# EAGLE design rpi2_test (EAGLE 7.6.0)
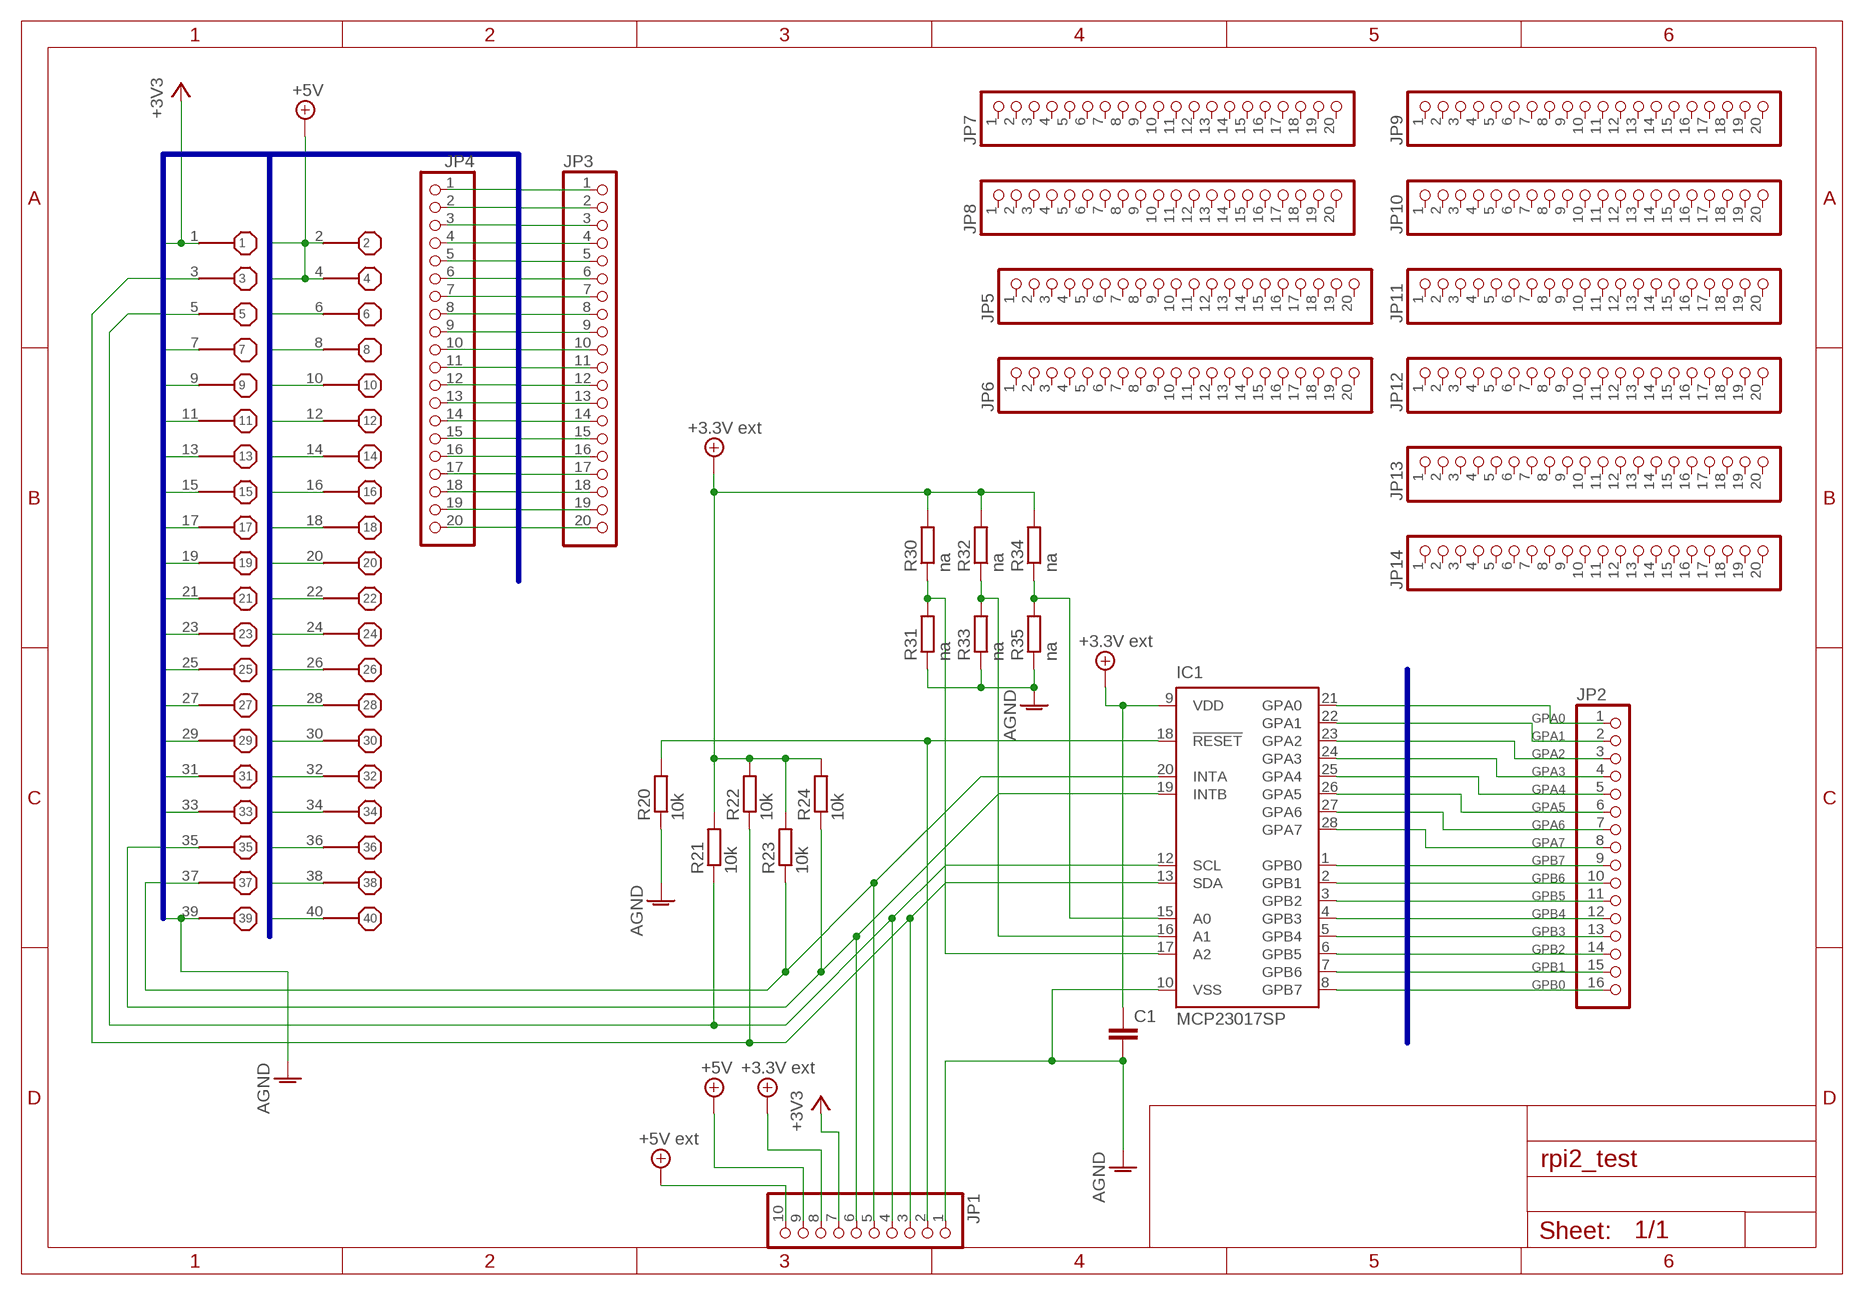
[diagram p0: schematic, sheet 1]

## Parts
C1  C-EUC1210  [C1210]
IC1  MCP23017SP  [DIL28-3]
JP1  PINHD-1X10  [1X10]
JP2  PINHD-1X16  [1X16]
JP3  PINHD-1X20  [1X20]
JP4  PINHD-1X20  [1X20]
JP5  PINHD-1X20  [1X20]
JP6  PINHD-1X20  [1X20]
JP7  PINHD-1X20  [1X20]
JP8  PINHD-1X20  [1X20]
JP9  PINHD-1X20  [1X20]
JP10  PINHD-1X20  [1X20]
JP11  PINHD-1X20  [1X20]
JP12  PINHD-1X20  [1X20]
JP13  PINHD-1X20  [1X20]
JP14  PINHD-1X20  [1X20]
R20  10k  R-EU_R0805  [R0805]
R21  10k  R-EU_R0805  [R0805]
R22  10k  R-EU_R0805  [R0805]
R23  10k  R-EU_R0805  [R0805]
R24  10k  R-EU_R0805  [R0805]
R30  na  R-EU_R0805  [R0805]
R31  na  R-EU_R0805  [R0805]
R32  na  R-EU_R0805  [R0805]
R33  na  R-EU_R0805  [R0805]
R34  na  R-EU_R0805  [R0805]
R35  na  R-EU_R0805  [R0805]
X1  B+_GPIO  [B+_GPIO]

## Nets
3.3VEXT: C1.1 IC1.9(VDD) JP1.8 R21.2 R22.2 R23.2 R24.2 R30.2 R32.2 R34.2 ; supply symbol labelled +3.3V ext
+3V3: JP1.7 JP4.1 X1.1
+5V: JP1.9 JP3.1 JP3.2 X1.2 X1.4
+5V/1: JP1.10 ; supply symbol labelled +5V ext
AGND: C1.2 IC1.10(VSS) JP1.1 R20.1 R31.1 R33.1 R35.1 X1.39
GPA0: IC1.21(GPA0) JP2.1
GPA1: IC1.22(GPA1) JP2.2
GPA2: IC1.23(GPA2) JP2.3
GPA3: IC1.24(GPA3) JP2.4
GPA4: IC1.25(GPA4) JP2.5
GPA5: IC1.26(GPA5) JP2.6
GPA6: IC1.27(GPA6) JP2.7
GPA7: IC1.28(GPA7) JP2.8
GPB0: IC1.1(GPB0) JP2.16
GPB1: IC1.2(GPB1) JP2.15
GPB2: IC1.3(GPB2) JP2.14
GPB3: IC1.4(GPB3) JP2.13
GPB4: IC1.5(GPB4) JP2.12
GPB5: IC1.6(GPB5) JP2.11
GPB6: IC1.7(GPB6) JP2.10
GPB7: IC1.8(GPB7) JP2.9
GPIO3: IC1.13(SDA) JP1.3 JP4.2 R22.1 X1.3
GPIO5: IC1.12(SCL) JP1.4 JP4.3 R21.1 X1.5
GPIO6: JP3.3 X1.6
GPIO7: JP4.4 X1.7
GPIO8: JP3.4 X1.8
GPIO9: JP4.5 X1.9
GPIO10: JP3.5 X1.10
GPIO11: JP4.6 X1.11
GPIO12: JP3.6 X1.12
GPIO13: JP4.7 X1.13
GPIO14: JP3.7 X1.14
GPIO15: JP4.8 X1.15
GPIO16: JP3.8 X1.16
GPIO17: JP4.9 X1.17
GPIO18: JP3.9 X1.18
GPIO19: JP4.10 X1.19
GPIO20: JP3.10 X1.20
GPIO21: JP4.11 X1.21
GPIO22: JP3.11 X1.22
GPIO23: JP4.12 X1.23
GPIO24: JP3.12 X1.24
GPIO25: JP4.13 X1.25
GPIO26: JP3.13 X1.26
GPIO27: JP4.14 X1.27
GPIO28: JP3.14 X1.28
GPIO29: JP4.15 X1.29
GPIO30: JP3.15 X1.30
GPIO31: JP4.16 X1.31
GPIO32: JP3.16 X1.32
GPIO33: JP4.17 X1.33
GPIO34: JP3.17 X1.34
GPIO35: IC1.19(INTB) JP1.6 JP4.18 R24.1 X1.35
GPIO36: JP3.18 X1.36
GPIO37: IC1.20(INTA) JP1.5 JP4.19 R23.1 X1.37
GPIO38: JP3.19 X1.38
GPIO39: JP4.20
GPIO40: JP3.20 X1.40
N$1: IC1.18(!RESET) JP1.2 R20.2
N$23: IC1.17(A2) R30.1 R31.2
N$29: IC1.16(A1) R32.1 R33.2
N$30: IC1.15(A0) R34.1 R35.2
Unconnected: JP5.1 JP5.2 JP5.3 JP5.4 JP5.5 JP5.6 JP5.7 JP5.8 JP5.9 JP5.10 JP5.11 JP5.12 JP5.13 JP5.14 JP5.15 JP5.16 JP5.17 JP5.18 JP5.19 JP5.20 JP6.1 JP6.2 JP6.3 JP6.4 JP6.5 JP6.6 JP6.7 JP6.8 JP6.9 JP6.10 JP6.11 JP6.12 JP6.13 JP6.14 JP6.15 JP6.16 JP6.17 JP6.18 JP6.19 JP6.20 JP7.1 JP7.2 JP7.3 JP7.4 JP7.5 JP7.6 JP7.7 JP7.8 JP7.9 JP7.10 JP7.11 JP7.12 JP7.13 JP7.14 JP7.15 JP7.16 JP7.17 JP7.18 JP7.19 JP7.20 JP8.1 JP8.2 JP8.3 JP8.4 JP8.5 JP8.6 JP8.7 JP8.8 JP8.9 JP8.10 JP8.11 JP8.12 JP8.13 JP8.14 JP8.15 JP8.16 JP8.17 JP8.18 JP8.19 JP8.20 JP9.1 JP9.2 JP9.3 JP9.4 JP9.5 JP9.6 JP9.7 JP9.8 JP9.9 JP9.10 JP9.11 JP9.12 JP9.13 JP9.14 JP9.15 JP9.16 JP9.17 JP9.18 JP9.19 JP9.20 JP10.1 JP10.2 JP10.3 JP10.4 JP10.5 JP10.6 JP10.7 JP10.8 JP10.9 JP10.10 JP10.11 JP10.12 JP10.13 JP10.14 JP10.15 JP10.16 JP10.17 JP10.18 JP10.19 JP10.20 JP11.1 JP11.2 JP11.3 JP11.4 JP11.5 JP11.6 JP11.7 JP11.8 JP11.9 JP11.10 JP11.11 JP11.12 JP11.13 JP11.14 JP11.15 JP11.16 JP11.17 JP11.18 JP11.19 JP11.20 JP12.1 JP12.2 JP12.3 JP12.4 JP12.5 JP12.6 JP12.7 JP12.8 JP12.9 JP12.10 JP12.11 JP12.12 JP12.13 JP12.14 JP12.15 JP12.16 JP12.17 JP12.18 JP12.19 JP12.20 JP13.1 JP13.2 JP13.3 JP13.4 JP13.5 JP13.6 JP13.7 JP13.8 JP13.9 JP13.10 JP13.11 JP13.12 JP13.13 JP13.14 JP13.15 JP13.16 JP13.17 JP13.18 JP13.19 JP13.20 JP14.1 JP14.2 JP14.3 JP14.4 JP14.5 JP14.6 JP14.7 JP14.8 JP14.9 JP14.10 JP14.11 JP14.12 JP14.13 JP14.14 JP14.15 JP14.16 JP14.17 JP14.18 JP14.19 JP14.20

## Buses
GPA[0..7],GPB[0..7]
GPIO[1..40]

## Library data of the parts
C1 = rcl:C-EU: CAPACITOR, European symbol
IC1 = microchip:MCP23017: http://ww1.microchip.com/downloads/en/DeviceDoc/21952a.pdf Source: http://ww1.microchip.com/downloads/en/DeviceDoc/21952a.pdf; MF: MICROCHIP; MPN: MCP23017-E/SP; OC_FARNELL: 1332088; OC_NEWARK: 31K2959
JP1 = pinhead:PINHD-1X10: PIN HEADER
JP2 = pinhead:PINHD-1X16: PIN HEADER
JP3-JP14 = pinhead:PINHD-1X20: PIN HEADER
R20-R24 R30-R35 = rcl:R-EU_: RESISTOR, European symbol
X1 = raspberry:B+_GPIO

## Board
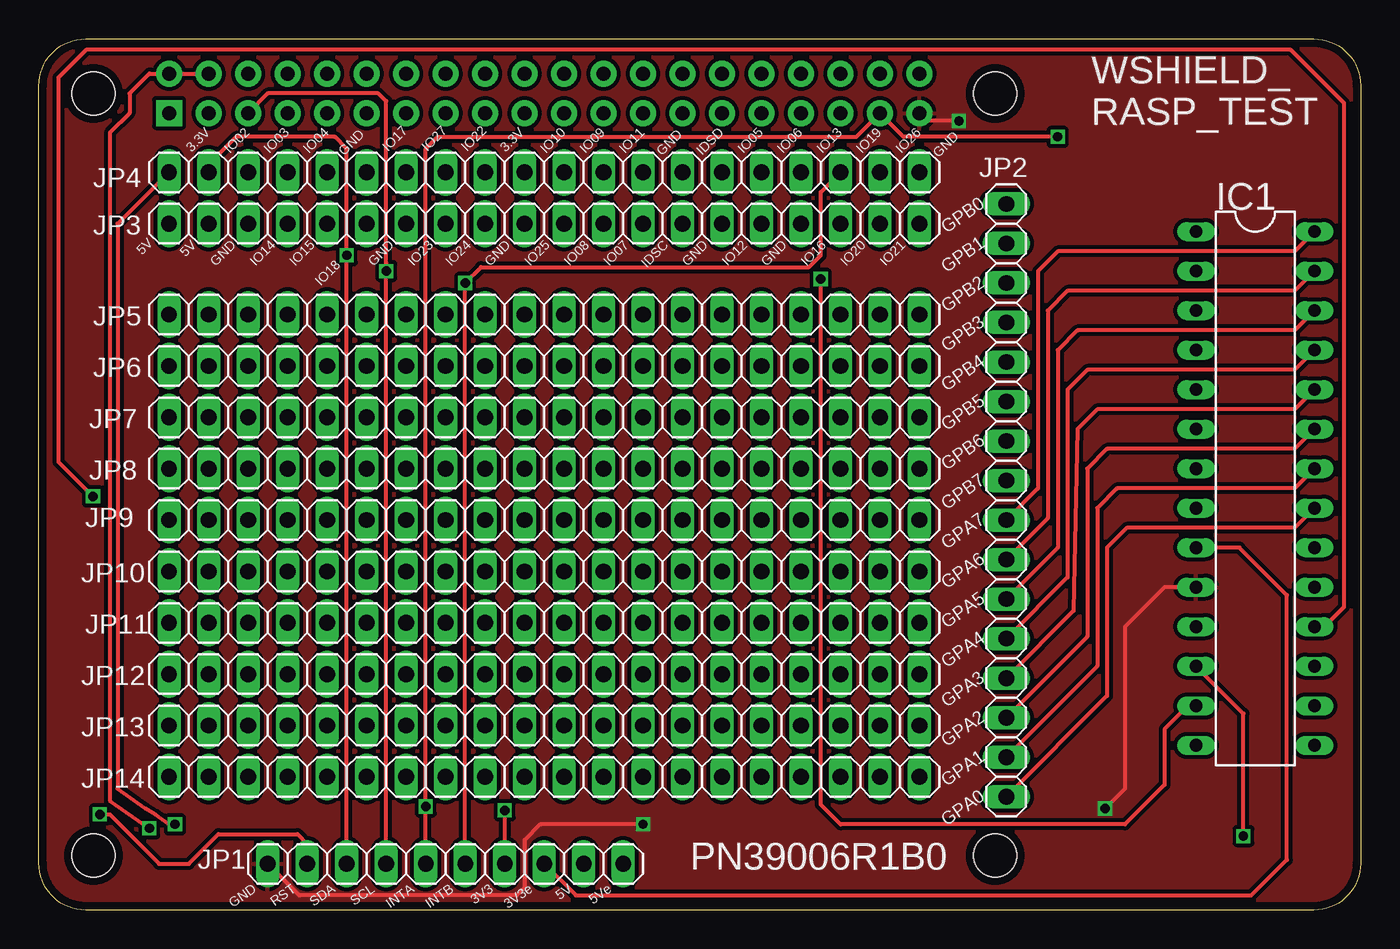
[diagram p1: board, top side]
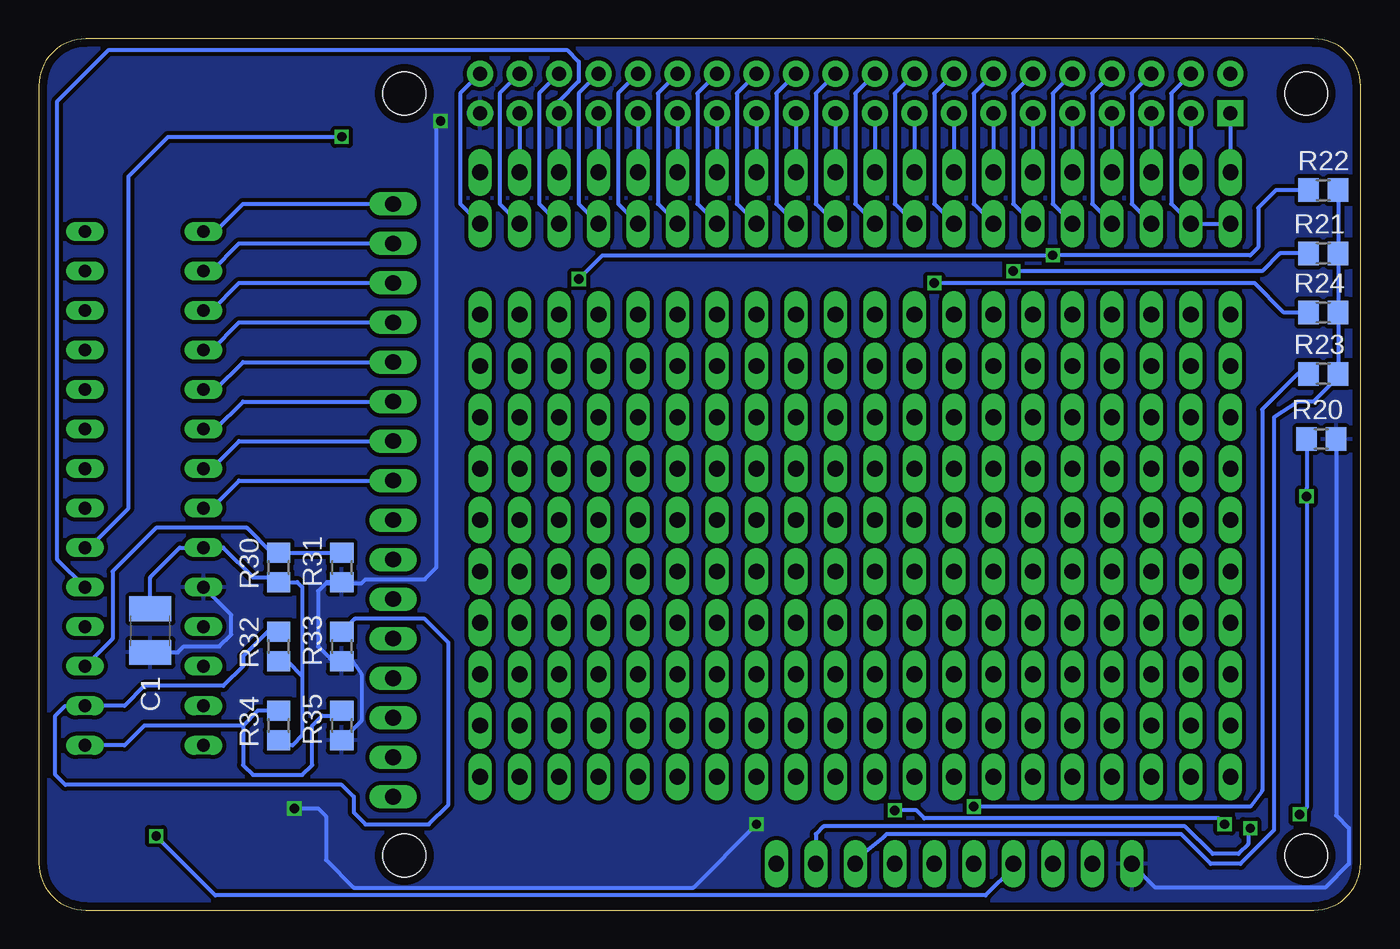
[diagram p2: board, bottom side, seen from below]

Size 85 x 56 mm. Coordinates in mm from the lower left corner, seen from the top.
Outline: 0,53 arc-90 3,56 82,56 arc-90 85,53 85,3 arc-90 82,0 3,0 arc-90 0,3 0,53
Copper layers (1*16): Top 0.035mm / dielectric 1.6mm / Bottom 0.035mm
Design rules "Elecrow_2-layer_PCB_eagle_rule": minimum track width 6mil, minimum drill 12mil, track to track 6mil, track to pad 6mil, pad to pad 6mil, via to via 8mil, smd to smd 0mil, copper to edge 20mil, drill to drill 10mil, minimum pad ring 6mil, minimum via ring 6mil, stop-mask expansion 0mil, vias tented up to drill 100mil, thermal gap 10mil
Holes 2.75 mm at 3.5,52.5 3.5,3.5 61.5,52.5 61.5,3.5

### Footprints (pad centres in the part's own frame; a part is rotated, then mirrored left to right if it is on the bottom)
C1210 = smd 1.6 x 2.7: 1 -1.4,0; 2 1.4,0
DIL28-3 = drill 0.813 long: 1 -16.51,-3.81; 2 -13.97,-3.81; 3 -11.43,-3.81; 4 -8.89,-3.81; 5 -6.35,-3.81; 6 -3.81,-3.81; 7 -1.27,-3.81; 8 1.27,-3.81; 9 3.81,-3.81; 10 6.35,-3.81; 11 8.89,-3.81; 12 11.43,-3.81; 13 13.97,-3.81; 14 16.51,-3.81; 15 16.51,3.81; 16 13.97,3.81; 17 11.43,3.81; 18 8.89,3.81; 19 6.35,3.81; 20 3.81,3.81; 21 1.27,3.81; 22 -1.27,3.81; 23 -3.81,3.81; 24 -6.35,3.81; 25 -8.89,3.81; 26 -11.43,3.81; 27 -13.97,3.81; 28 -16.51,3.81
1X10 = drill 1.016 long: 1 -11.43,0; 2 -8.89,0; 3 -6.35,0; 4 -3.81,0; 5 -1.27,0; 6 1.27,0; 7 3.81,0; 8 6.35,0; 9 8.89,0; 10 11.43,0
1X16 = drill 1.016 long: 1 -19.05,0; 2 -16.51,0; 3 -13.97,0; 4 -11.43,0; 5 -8.89,0; 6 -6.35,0; 7 -3.81,0; 8 -1.27,0; 9 1.27,0; 10 3.81,0; 11 6.35,0; 12 8.89,0; 13 11.43,0; 14 13.97,0; 15 16.51,0; 16 19.05,0
1X20 = drill 1.016 long: 1 -24.13,0; 2 -21.59,0; 3 -19.05,0; 4 -16.51,0; 5 -13.97,0; 6 -11.43,0; 7 -8.89,0; 8 -6.35,0; 9 -3.81,0; 10 -1.27,0; 11 1.27,0; 12 3.81,0; 13 6.35,0; 14 8.89,0; 15 11.43,0; 16 13.97,0; 17 16.51,0; 18 19.05,0; 19 21.59,0; 20 24.13,0
R0805 = smd 1.3 x 1.5: 1 -0.95,0; 2 0.95,0
B+_GPIO = drill 0.9 pad 1.676 square: 1 -24.13,-1.27 | drill 0.9 pad 1.676: 2 -24.13,1.27; 3 -21.59,-1.27; 4 -21.59,1.27; 5 -19.05,-1.27; 6 -19.05,1.27; 7 -16.51,-1.27; 8 -16.51,1.27; 9 -13.97,-1.27; 10 -13.97,1.27; 11 -11.43,-1.27; 12 -11.43,1.27; 13 -8.89,-1.27; 14 -8.89,1.27; 15 -6.35,-1.27; 16 -6.35,1.27; 17 -3.81,-1.27; 18 -3.81,1.27; 19 -1.27,-1.27; 20 -1.27,1.27; 21 1.27,-1.27; 22 1.27,1.27; 23 3.81,-1.27; 24 3.81,1.27; 25 6.35,-1.27; 26 6.35,1.27; 27 8.89,-1.27; 28 8.89,1.27; 29 11.43,-1.27; 30 11.43,1.27; 31 13.97,-1.27; 32 13.97,1.27; 33 16.51,-1.27; 34 16.51,1.27; 35 19.05,-1.27; 36 19.05,1.27; 37 21.59,-1.27; 38 21.59,1.27; 39 24.13,-1.27; 40 24.13,1.27

### Placement (x,y rotation side)
C1  77.84,17.96 270 bottom
IC1  78.22,27.1 270 top
JP1  26.15,2.97 0 top
JP2  62.22,26.34 90 top
JP3  32.5,44.12 0 top
JP4  32.5,47.42 0 top
JP5  32.5,38.28 0 top
JP6  32.5,34.97 0 top
JP7  32.5,31.67 0 top
JP8  32.5,28.37 0 top
JP9  32.5,25.07 0 top
JP10  32.5,21.77 0 top
JP11  32.5,18.46 0 top
JP12  32.5,15.16 0 top
JP13  32.5,11.86 0 top
JP14  32.5,8.56 0 top
R20  2.53,30.27 180 bottom
R21  2.4,42.21 0 bottom
R22  2.4,46.28 0 bottom
R23  2.4,34.47 0 bottom
R24  2.4,38.4 0 bottom
R30  69.58,22.02 270 bottom
R31  65.52,22.02 90 bottom
R32  69.58,16.94 270 bottom
R33  65.52,16.94 90 bottom
R34  69.58,11.86 270 bottom
R35  65.52,11.86 90 bottom
X1  32.5,52.5 0 top

### Tracks (layer width: path | path; a pad name or v marks a point on that pad's centre or on a via)
3.3VEXT
  Top 0.254: JP1.8 34.53,0.94 77.97,0.94 80.25,3.22 80.25,20.24 77.2,23.29 IC1.9
  Bottom 0.254: 68.06,15.04 68.06,20.75 68.38,21.07 R30.2 69.9,21.39 71.23,21.39 73.14,23.29 IC1.9 75.93,23.29 77.84,21.39 C1.1 | 68.06,15.04 68.06,11.23 68.69,10.59 69.26,10.59 R34.2 | R32.2 69.02,15.99 68.06,15.04 | R22.2 R21.2 R24.2 R23.2 1.45,34.27 3.04,32.69 4.05,32.69 5.58,31.67 5.58,5.13 7.74,2.97 9.64,2.97 11.55,4.88 30.48,4.88 30.67,4.69 | JP1.8 32.5,3.22 30.67,4.69 | 30.67,4.69 30.59,4.75
+3V3  (via drill 0.6)
  Top 0.254: JP4.1 5.07,44.12 5.07,7.8 6.85,6.53 7.48,6.15 8.37,5.51 v8.75,5.51 | v29.96,6.4 JP1.7
  Bottom 0.254: X1.1 JP4.1 | v8.75,5.51 9.13,5.89 28.05,5.89 28.56,6.4 v29.96,6.4
+5V  (via drill 0.6)
  Top 0.254: v7.1,5.26 4.56,7.03 4.56,49.96 5.83,51.23 5.83,52.5 7.1,53.77 X1.2 X1.4
  Bottom 0.254: JP1.9 35.04,4.88 34.53,5.38 11.29,5.38 9.51,3.6 7.86,3.6 7.23,4.24 7.23,5.13 v7.1,5.26 | X1.4 12.18,52.5 12.18,45.39 JP3.2 JP3.1
AGND  (via drill 0.6)
  Top 0.254: v59.17,50.72 57.14,50.72 X1.39 | IC1.10 72.38,20.75 69.84,18.21 69.84,7.8 v68.57,6.53 | v38.85,5.51 32.25,5.51 31.23,4.49 31.23,1.45 30.72,0.94 16.75,0.94 JP1.1
  Bottom 0.254: R20.1 1.58,6.08 0.75,5.26 0.75,2.97 2.27,1.45 13.2,1.45 JP1.1 | R35.1 64.25,12.18 64.25,15.16 64.82,15.99 R33.1 65.71,16.18 66.28,16.18 67.04,16.94 67.04,20.5 66.54,21 | R31.1 66.47,21.07 66.54,21 | 66.54,21 64.25,21 64,21.26 60.19,21.26 59.42,22.02 59.42,50.47 v59.17,50.72 | C1.2 76.06,16.56 75.68,16.94 73.39,16.94 72.63,17.7 72.63,18.97 IC1.10 | v68.57,6.53 67.04,6.53 66.54,6.02 66.54,3.22 64.76,1.45 42.91,1.45 v38.85,5.51
  pour Top (isolate 0.254): -0.01,53.52 arc-90 2.53,56.06 2.78,56.06 82.28,56.06 arc-90 85.08,53.26 85.08,2.97 arc-90 82.03,-0.08 81.78,-0.08 3.04,-0.08 arc-90 -0.01,2.97
  pour Bottom (isolate 0.254): -0.01,53.26 arc-90 2.78,56.06 3.04,56.06 82.28,56.06 arc-90 85.08,53.26 85.08,2.72 arc-90 82.28,-0.08 81.52,-0.08 3.04,-0.08 arc-90 -0.01,2.97 -0.01,3.22
GPA0
  Top 0.254: IC1.21 80.76,24.56 69.96,24.56 68.69,23.29 68.69,13.77 JP2.1
GPA1
  Top 0.254: IC1.22 80.76,27.1 69.33,27.1 68.06,25.83 68.06,15.67 JP2.2
GPA2
  Top 0.254: IC1.23 80.76,29.64 68.69,29.64 67.42,28.37 67.42,17.57 JP2.3
GPA3
  Top 0.254: IC1.24 80.76,32.18 68.06,32.18 66.79,30.91 66.54,19.23 JP2.4
GPA4
  Top 0.254: IC1.25 80.76,34.72 67.42,34.72 66.15,33.45 66.15,21.39 JP2.5
GPA5
  Top 0.254: IC1.26 80.76,37.26 66.79,37.26 65.52,35.99 65.52,23.29 JP2.6
GPA6
  Top 0.254: IC1.27 80.76,39.8 66.15,39.8 64.88,38.53 64.88,25.2 JP2.7
GPA7
  Top 0.254: IC1.28 80.76,42.34 65.52,42.34 64.25,41.07 64.25,27.1 JP2.8
GPB0
  Bottom 0.254: IC1.1 73.65,43.61 71.87,45.39 JP2.16
GPB1
  Bottom 0.254: IC1.2 73.9,41.07 72.12,42.85 JP2.15
GPB2
  Bottom 0.254: IC1.3 73.9,38.53 72.12,40.31 JP2.14
GPB3
  Bottom 0.254: IC1.4 73.9,35.99 72.12,37.77 JP2.13
GPB4
  Bottom 0.254: IC1.5 73.65,33.45 71.87,35.23 JP2.12
GPB5
  Bottom 0.254: IC1.6 73.65,30.91 71.87,32.69 JP2.11
GPB6
  Bottom 0.254: IC1.7 73.9,28.37 72.12,30.15 JP2.10
GPB7
  Bottom 0.254: IC1.8 73.9,25.83 72.12,27.61 JP2.9
GPIO3  (via drill 0.6)
  Top 0.254: JP1.3 v19.8,42.09 19.8,48.94 19.04,49.71 12.69,49.71 10.91,47.93 JP4.2 | IC1.13 73.9,13.13 72.38,11.61 72.38,8.05 69.84,5.51 51.55,5.51 50.28,6.78 v50.28,40.56
  Bottom 0.254: X1.3 JP4.2 | R22.1 5.45,46.28 6.59,45.13 6.59,42.59 7.1,42.09 v19.8,42.09 48.76,42.09 v50.28,40.56
GPIO5  (via drill 0.6)
  Top 0.254: v77.46,4.75 77.46,12.62 IC1.12 | JP1.4 v22.34,41.07 22.34,41.58 22.34,51.99 21.83,52.5 14.72,52.5 X1.5
  Bottom 0.254: JP1.4 22.34,2.72 24.12,0.94 73.65,0.94 v77.46,4.75 | X1.5 JP4.3 | R21.1 5.2,42.21 6.34,41.07 v22.34,41.07
GPIO6
  Bottom 0.254: X1.6 14.72,52.5 14.72,45.39 JP3.3
GPIO7
  Bottom 0.254: X1.7 JP4.4
GPIO8
  Bottom 0.254: X1.8 17.26,52.5 17.26,45.39 JP3.4
GPIO9
  Bottom 0.254: X1.9 JP4.5
GPIO10
  Bottom 0.254: X1.10 19.8,52.5 19.8,45.39 JP3.5
GPIO11
  Bottom 0.254: X1.11 JP4.6
GPIO12
  Bottom 0.254: X1.12 22.34,52.5 22.34,45.39 JP3.6
GPIO13
  Bottom 0.254: X1.13 JP4.7
GPIO14
  Bottom 0.254: X1.14 24.88,52.5 24.88,45.39 JP3.7
GPIO15
  Bottom 0.254: X1.15 JP4.8
GPIO16
  Bottom 0.254: X1.16 27.42,52.5 27.42,45.39 JP3.8
GPIO17
  Bottom 0.254: X1.17 JP4.9
GPIO18
  Bottom 0.254: X1.18 29.96,52.5 29.96,45.39 JP3.9
GPIO19
  Bottom 0.254: X1.19 JP4.10
GPIO20
  Bottom 0.254: X1.20 32.5,52.5 32.5,45.39 JP3.10
GPIO21
  Bottom 0.254: X1.21 JP4.11
GPIO22
  Bottom 0.254: X1.22 35.04,52.5 35.04,45.39 JP3.11
GPIO23
  Bottom 0.254: X1.23 JP4.12
GPIO24
  Bottom 0.254: X1.24 37.58,52.5 37.58,45.39 JP3.12
GPIO25
  Bottom 0.254: X1.25 JP4.13
GPIO26
  Bottom 0.254: X1.26 40.12,52.5 40.12,45.39 JP3.13
GPIO27
  Bottom 0.254: X1.27 JP4.14
GPIO28
  Bottom 0.254: X1.28 42.66,52.5 42.66,45.39 JP3.14
GPIO29
  Bottom 0.254: X1.29 JP4.15
GPIO30
  Bottom 0.254: X1.30 45.2,52.5 45.2,45.39 JP3.15
GPIO31
  Bottom 0.254: X1.31 JP4.16
GPIO32
  Bottom 0.254: X1.32 47.74,52.5 47.74,45.39 JP3.16
GPIO33
  Bottom 0.254: X1.33 JP4.17
GPIO34
  Bottom 0.254: X1.34 50.28,52.5 50.28,45.39 JP3.17
GPIO35  (via drill 0.6)
  Top 0.254: JP1.6 v27.42,40.31 28.44,41.32 49.52,41.32 50.28,42.09 50.28,46.15 JP4.18
  Bottom 0.254: JP4.18 X1.35 51.55,51.99 50.28,53.26 50.28,54.53 51.04,55.29 80.51,55.29 83.81,51.99 83.81,22.53 IC1.19 | R24.1 4.94,38.4 6.85,40.31 v27.42,40.31
GPIO36
  Bottom 0.254: X1.36 52.82,52.5 52.82,45.39 JP3.18
GPIO37  (via drill 0.6)
  Top 0.254: JP1.5 v24.88,6.65 24.88,48.94 25.64,49.71 52.57,49.71 X1.37 55.61,49.71 v65.52,49.71
  Bottom 0.254: X1.37 JP4.19 | IC1.20 81.78,23.29 79.24,25.83 79.24,47.17 76.7,49.71 v65.52,49.71 | R23.1 4.05,34.47 6.34,32.18 6.34,7.67 7.1,6.65 v24.88,6.65
GPIO38
  Bottom 0.254: X1.38 55.36,52.5 55.36,45.39 JP3.19
GPIO40
  Bottom 0.254: X1.40 57.9,52.5 57.9,45.39 JP3.20
N$1  (via drill 0.6)
  Top 0.254: v3.92,6.15 4.56,6.15 7.74,2.97 9.64,2.97 11.55,4.88 16.62,4.88 17.26,4.24 JP1.2 | IC1.18 82.66,18.21 83.93,19.48 83.93,51.87 80.51,55.29 3.04,55.29 1.26,53.52 1.26,28.81 v3.48,26.59
  Bottom 0.254: R20.2 3.48,27.1 v3.48,26.59 3.48,6.59 v3.92,6.15
N$23
  Bottom 0.254: R31.2 R30.1 70.03,22.97 71.62,24.56 77.46,24.56 80.25,21.77 80.25,17.45 IC1.17
N$29
  Bottom 0.254: R32.1 70.28,17.89 71.87,16.3 71.87,15.67 73.14,14.4 78.22,14.4 79.49,13.13 IC1.16 83.3,13.13 83.93,12.5 83.93,8.69 83.3,8.05 65.52,8.05 64.76,7.29 64.76,6.27 64,5.51 59.93,5.51 58.66,6.78 58.66,17.19 60.19,18.72 64.69,18.72 R33.2 65.2,17.89
N$30
  Bottom 0.254: 71.87,11.86 78.22,11.86 79.49,10.59 IC1.15 | R34.1 70.92,12.81 71.87,11.86 | 71.87,11.86 71.87,9.32 71.23,8.69 68.06,8.69 67.42,9.32 67.42,11.86 66.79,12.5 65.83,12.5 R35.2

### Text on the board
tNames: IO17 | IO27 | IO22 | WSHIELD_ / RASP_TEST | 3.3V | IO02 | IO03 | IO04 | GND | 3.3V | IO10 | IO09 | IO11 | GND | IDSD | IO05 | IO06 | IO13 | IO19 | IO26 | GND | GPB0 | 5V | 5V | GND | IO14 | IO15 | GND | IO23 | IO24 | GND | IO25 | IO08 | IO07 | IDSC | GND | IO12 | GND | IO16 | IO20 | IO21 | GPB1 | IO18 | GPB2 | GPB3 | GPB4 | GPB5 | GPB6 | GPB7 | GPA7 | GPA6 | GPA5 | GPA4 | GPA3 | GPA2 | GPA1 | GPA0 | PN39006R1B0 | GND | RST | SDA | SCL | INTA | INTB | 3V3 | 3V3e | 5V | 5Ve
tTest: GND | SDA | SCL | INTB | INTA | 3.3V | 3.3Ve | 5V | 5Ve